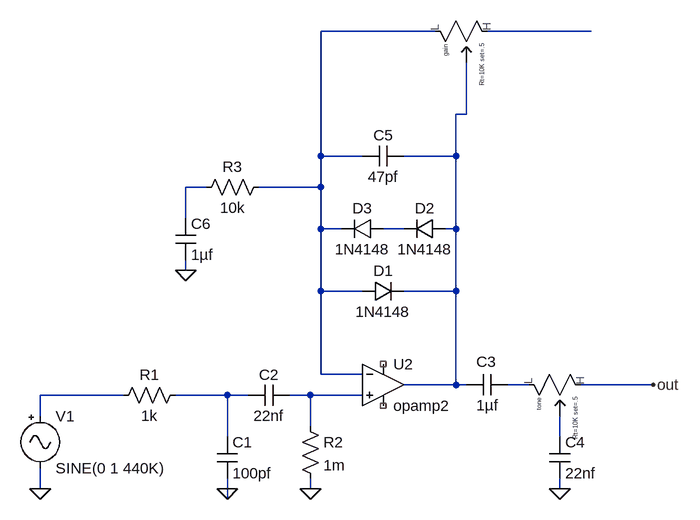
[diagram p0: schematic wampler_opamp1.asc]
wampler_opamp1.asc, the LTspice schematic file:
Version 4
SHEET 1 1016 680
WIRE 304 -496 128 -496
WIRE 544 -496 384 -496
WIRE 352 -368 352 -448
WIRE 352 -368 336 -368
WIRE 128 -304 128 -496
WIRE 192 -304 128 -304
WIRE 336 -304 336 -368
WIRE 336 -304 256 -304
WIRE -48 -256 -80 -256
WIRE 128 -256 128 -304
WIRE 128 -256 32 -256
WIRE -80 -208 -80 -256
WIRE 128 -192 128 -256
WIRE 160 -192 128 -192
WIRE 256 -192 224 -192
WIRE 336 -192 336 -304
WIRE 336 -192 320 -192
WIRE -80 -128 -80 -144
WIRE 128 -96 128 -192
WIRE 192 -96 128 -96
WIRE 336 -96 336 -192
WIRE 336 -96 256 -96
WIRE 128 32 128 -96
WIRE 192 32 128 32
WIRE 336 48 336 -96
WIRE 336 48 256 48
WIRE 352 48 336 48
WIRE 448 48 416 48
WIRE 640 48 528 48
WIRE -176 64 -304 64
WIRE -16 64 -96 64
WIRE 16 64 -16 64
WIRE 112 64 80 64
WIRE 192 64 112 64
WIRE -304 96 -304 64
WIRE 112 112 112 64
WIRE -16 128 -16 64
WIRE 496 128 496 96
WIRE -304 208 -304 176
WIRE -16 208 -16 192
WIRE 112 208 112 192
WIRE 496 208 496 192
WIRE -16 224 -16 208
FLAG 112 208 0
FLAG -16 208 0
FLAG -304 208 0
FLAG 496 208 0
FLAG -80 -128 0
FLAG 640 48 out
SYMBOL diode 192 -80 R270
WINDOW 0 32 32 VTop 2
WINDOW 3 0 32 VBottom 2
SYMATTR InstName D1
SYMATTR Value 1N4148
SYMBOL diode 320 -208 R90
WINDOW 0 0 32 VBottom 2
WINDOW 3 32 32 VTop 2
SYMATTR InstName D2
SYMATTR Value 1N4148
SYMBOL diode 224 -208 R90
WINDOW 0 0 32 VBottom 2
WINDOW 3 32 32 VTop 2
SYMATTR InstName D3
SYMATTR Value 1N4148
SYMBOL OpAmps\\opamp2 224 -16 R0
SYMATTR InstName U2
SYMBOL res -80 48 R90
WINDOW 0 0 56 VBottom 2
WINDOW 3 32 56 VTop 2
SYMATTR InstName R1
SYMATTR Value 1k
SYMBOL res 96 96 R0
SYMATTR InstName R2
SYMATTR Value 1m
SYMBOL cap -32 128 R0
SYMATTR InstName C1
SYMATTR Value 100pf
SYMBOL cap 80 48 R90
WINDOW 0 0 32 VBottom 2
WINDOW 3 32 32 VTop 2
SYMATTR InstName C2
SYMATTR Value 22nf
SYMBOL cap 416 32 R90
WINDOW 0 -4 33 VBottom 2
WINDOW 3 32 32 VTop 2
SYMATTR InstName C3
SYMATTR Value 1µf
SYMBOL cap 192 -288 R270
WINDOW 0 32 32 VTop 2
WINDOW 3 0 32 VBottom 2
SYMATTR InstName C5
SYMATTR Value 47pf
SYMBOL cap -96 -208 R0
SYMATTR InstName C6
SYMATTR Value 1µf
SYMBOL Misc\\signal -304 80 R0
WINDOW 123 0 0 Left 0
WINDOW 39 0 0 Left 0
SYMATTR InstName V1
SYMATTR Value SINE(0 1 440K)
SYMBOL pot 432 32 M90
SYMATTR InstName tone
SYMATTR SpiceModel PotLin
SYMBOL pot 288 -512 M90
SYMATTR InstName gain
SYMATTR SpiceModel pot_audio
SYMBOL cap 480 128 R0
SYMATTR InstName C4
SYMATTR Value 22nf
SYMBOL res 48 -272 R90
WINDOW 0 0 56 VBottom 2
WINDOW 3 32 56 VTop 2
SYMATTR InstName R3
SYMATTR Value 10k

The netlist it stands for:
* wampler_opamp1.asc
D1 N001 N003 1N4148
D2 N003 N005 1N4148
D3 N005 N001 1N4148
XU2 N009 N001 NC_01 NC_02 N003 opamp2  ; pins In+ In- V+ V- OUT
R1 N008 N007 1k
R2 N009 0 1m
C1 N008 0 100pf
C2 N009 N008 22nf
C3 N006 N003 1µf
C5 N001 N003 47pf
C6 N004 0 1µf
V1 N007 0 SINE(0 1 440K)
Xtone out N006 N010 PotLin Rt=10K set=.5  ; pins H L 3
Xgain N002 N001 N003 pot_audio Rt=10K set=.5  ; pins H L 3
C4 N010 0 22nf
R3 N001 N004 10k
.model D D
.lib standard.dio
.lib pote.lib
.backanno
.end